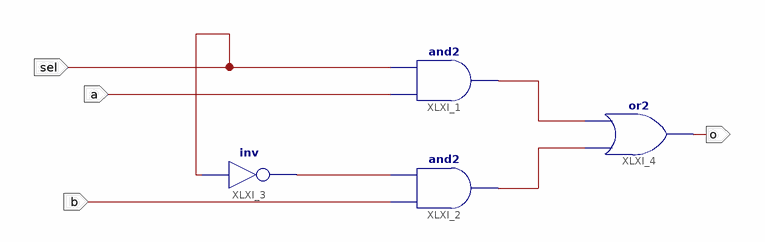
[diagram p0: schematic sheet 1]
// Xilinx ISE schematic mux2t1.sch (kintex7) as structural Verilog: 4 symbols, 4 ports
module mux2t1 (
  input  sel,
  input  a,
  input  b,
  output o
);

  wire XLXN_1, XLXN_5, XLXN_6;

  and XLXI_1 (XLXN_6, a, sel);
  and XLXI_2 (XLXN_5, b, XLXN_1);
  not XLXI_3 (XLXN_1, sel);
  or XLXI_4 (o, XLXN_5, XLXN_6);
endmodule
